# EAGLE design thermometer (EAGLE 7.2.0)
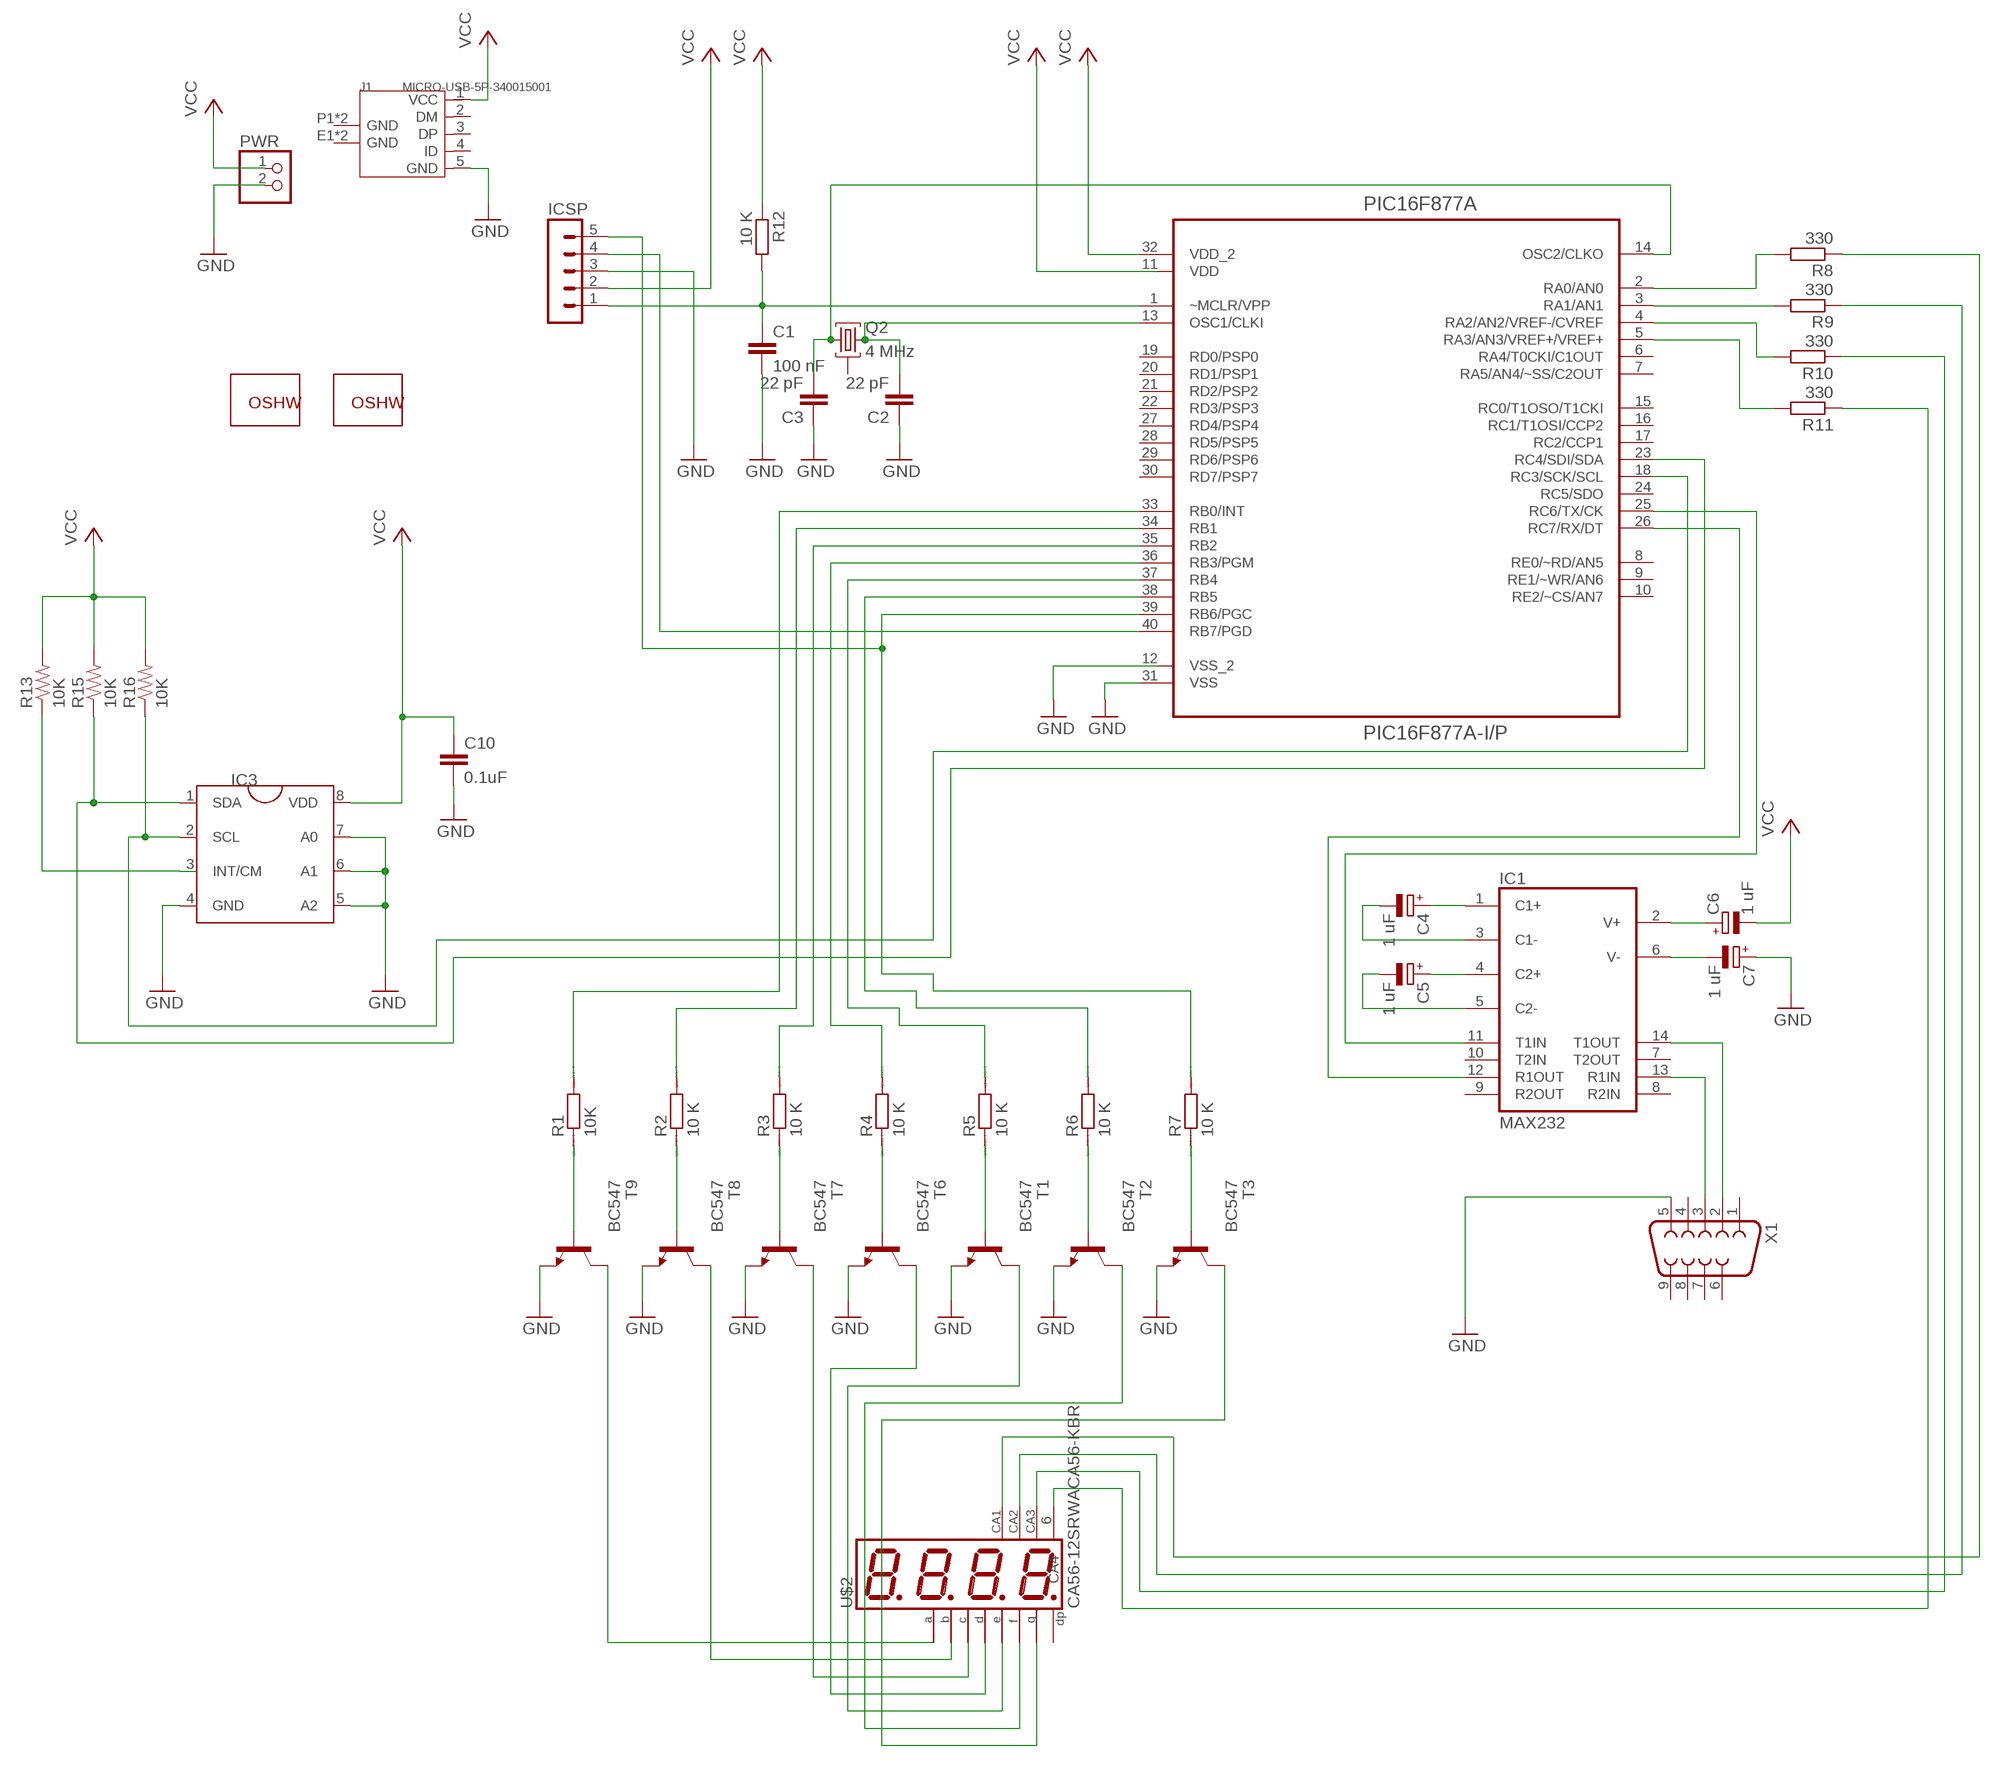
[diagram p0: schematic, sheet 1]

## Parts
C1  100 nF  C-EU050-025X075  [C050-025X075]
C2  22 pF  C-EU050-025X075  [C050-025X075]
C3  22 pF  C-EU050-025X075  [C050-025X075]
C4  1 uF  CPOL-EUE1.8-4  [E1,8-4]
C5  1 uF  CPOL-EUE1.8-4  [E1,8-4]
C6  1 uF  CPOL-EUE1.8-4  [E1,8-4]
C7  1 uF  CPOL-EUE1.8-4  [E1,8-4]
C10  0.1uF  0.1UF-25V-5%(0603)  [0603-CAP]
GOLD_ORB_SM1  OSHWLOGO_GOLD_ORB_LG  [OSHW0]
GOLD_ORB_SM2  OSHWLOGO_GOLD_ORB_SM  [OSHW2]
IC1  MAX232  [DIL16]
IC3  TCN75TCN75MUA  [MSOP8]
ICSP  MA05-1  [MA05-1]
J1  MICRO-USB-5P-340015001  [B-SMD-5P]
PIC16F877A  PIC16F877A-I/P  [DIP254P1524X483-40]
PWR  PINHD-1X2  [1X02]
Q2  4 MHz  54M10AUM1  [UM1]
R1  10K  R0207/10  [0207/10]
R2  10 K  R0207/10  [0207/10]
R3  10 K  R0207/10  [0207/10]
R4  10 K  R0207/10  [0207/10]
R5  10 K  R0207/10  [0207/10]
R6  10 K  R0207/10  [0207/10]
R7  10 K  R0207/10  [0207/10]
R8  330  R-EU_0204/7  [0204/7]
R9  330  R-EU_0204/7  [0204/7]
R10  330  R-EU_0204/7  [0204/7]
R11  330  R-EU_0204/7  [0204/7]
R12  10 K  R-EU_0204/7  [0204/7]
R13  10K  10KOHM-1/10W-1%(0603)0603  [0603-RES]
R15  10K  10KOHM-1/10W-1%(0603)0603  [0603-RES]
R16  10K  10KOHM-1/10W-1%(0603)0603  [0603-RES]
T1  BC547  [TO92]
T2  BC547  [TO92]
T3  BC547  [TO92]
T6  BC547  [TO92]
T7  BC547  [TO92]
T8  BC547  [TO92]
T9  BC547  [TO92]
U$2  CA56-12SRWACA56-KBR  [CA56]
X1  F09HP  [F09HP]

## Nets
GND: C1.2 C2.1 C3.1 C7.+ C10.2 IC3.4(GND) IC3.5(A2) IC3.6(A1) IC3.7(A0) ICSP.3 J1.5(GND) PIC16F877A.31(VSS) PWR.2 T1.1(E) T2.1(E) T3.1(E) T6.1(E) T7.1(E) T8.1(E) T9.1(E) X1.5
N$1: R1.1 T9.2(B)
N$2: R2.1 T8.2(B)
N$3: R3.1 T7.2(B)
N$4: R4.1 T6.2(B)
N$5: R5.1 T1.2(B)
N$6: R6.1 T2.2(B)
N$7: R7.1 T3.2(B)
N$8: PIC16F877A.33(RB0/INT) R1.2
N$9: PIC16F877A.34(RB1) R2.2
N$10: PIC16F877A.35(RB2) R3.2
N$11: PIC16F877A.36(RB3/PGM) R4.2
N$12: PIC16F877A.37(RB4) R5.2
N$13: PIC16F877A.38(RB5) R6.2
N$14: ICSP.5 PIC16F877A.39(RB6/PGC) R7.2
N$15: PIC16F877A.2(RA0/AN0) R8.2
N$16: PIC16F877A.3(RA1/AN1) R9.2
N$17: PIC16F877A.4(RA2/AN2/VREF-/CVREF) R10.2
N$18: PIC16F877A.5(RA3/AN3/VREF+/VREF+) R11.2
N$19: R8.1 U$2.12(CA)
N$20: C1.1 ICSP.1 PIC16F877A.1(~MCLR/VPP) R12.2
N$21: R9.1 U$2.9(CA)
N$22: R10.1 U$2.8(CA)
N$23: T9.3(C) U$2.11(A)
N$24: C2.2 PIC16F877A.13(OSC1/CLKI) Q2.3
N$25: T7.3(C) U$2.4(C)
N$26: T6.3(C) U$2.2(D)
N$27: T1.3(C) U$2.1(E)
N$28: T2.3(C) U$2.10(F)
N$29: T3.3(C) U$2.5(G)
N$30: ICSP.4 PIC16F877A.40(RB7/PGD)
N$31: R11.1 U$2.6(CA4)
N$32: IC3.2(SCL) PIC16F877A.18(RC3/SCK/SCL) R16.1
N$33: IC3.1(SDA) PIC16F877A.23(RC4/SDI/SDA) R15.1
N$35: C7.- IC1.6(V-)
N$36: C3.2 PIC16F877A.14(OSC2/CLKO) Q2.1
N$37: C6.+ IC1.2(V+)
N$38: C4.+ IC1.1(C1+)
N$39: C4.- IC1.3(C1-)
N$40: C5.+ IC1.4(C2+)
N$41: C5.- IC1.5(C2-)
N$42: IC1.11(T1IN) PIC16F877A.25(RC6/TX/CK)
N$43: IC1.14(T1OUT) X1.2
N$44: IC1.13(R1IN) X1.3
N$45: IC1.12(R1OUT) PIC16F877A.26(RC7/RX/DT)
N$47: T8.3(C) U$2.7(B)
N$49: IC3.3(INT/CM) R13.1
VCC: C6.- C10.1 IC3.8(VDD) ICSP.2 J1.1(VCC) PIC16F877A.32(VDD_2) PWR.1 R12.1 R13.2 R15.2 R16.2
Unconnected: IC1.7(T2OUT) IC1.8(R2IN) IC1.9(R2OUT) IC1.10(T2IN) J1.2(DM) J1.3(DP) J1.4(ID) J1.E1(GND) J1.E2(GND) J1.P1(GND) J1.P2(GND) PIC16F877A.6(RA4/T0CKI/C1OUT) PIC16F877A.7(RA5/AN4/~SS/C2OUT) PIC16F877A.8(RE0/~RD/AN5) PIC16F877A.9(RE1/~WR/AN6) PIC16F877A.10(RE2/~CS/AN7) PIC16F877A.15(RC0/T1OSO/T1CKI) PIC16F877A.16(RC1/T1OSI/CCP2) PIC16F877A.17(RC2/CCP1) PIC16F877A.19(RD0/PSP0) PIC16F877A.20(RD1/PSP1) PIC16F877A.21(RD2/PSP2) PIC16F877A.22(RD3/PSP3) PIC16F877A.24(RC5/SDO) PIC16F877A.27(RD4/PSP4) PIC16F877A.28(RD5/PSP5) PIC16F877A.29(RD6/PSP6) PIC16F877A.30(RD7/PSP7) Q2.2 U$2.3(DP) X1.1 X1.4 X1.6 X1.7 X1.8 X1.9

## Power pins joined to a net without a drawn wire
GND: IC1.15(GND)
VCC: IC1.16(VCC)
VDD: PIC16F877A.11(VDD)
VSS_2: PIC16F877A.12(VSS_2)

## Library data of the parts
C1-C3 = rcl:C-EU: CAPACITOR, European symbol
C4-C7 = rcl:CPOL-EU: POLARIZED CAPACITOR, European symbol
C10 = SparkFun-Capacitors:0.1UF-25V-5%(0603): CAP-08604; PROD_ID: CAP-08604
GOLD_ORB_SM1 GOLD_ORB_SM2 = NBitWonder:OSHWLOGO: These are Open-Source Hardware logos.
IC1 = maxim:MAX232: RS232 TRANSCEIVER; MF: MAXIM; MPN: MAX232ACPE+; OC_FARNELL: 9723773; OC_NEWARK: 68K4544
IC3 = instruction_set:TCN75: The TCN75 is a serially programmable temperature sensor that notifies the host controller when ambient temperature exceeds a user-programmed setpoint. Hysteresis is also programmable. The INT/CMPTR output is programmable as either a simple comparator for thermostat operation or as a temperature event interrupt. Communication with the TCN75 is accomplished via a two-wire bus that is compatible with industry standard protocols. This permits reading the current temperature, programming the setpoint and hysteresis, and configuring the device.
ICSP = con-lstb:MA05-1: PIN HEADER; OC_FARNELL: unknown; OC_NEWARK: unknown
J1 = Connector:MICRO-USB-5P: When you use the footprint ,place notice 46 (layer)milling ,there is some important information.
PIC16F877A = Microchip_By_element14_Batch_1:PIC16F877A-I/P: 8-Bit CMOS FLASH Microcontrollers; MPN: PIC16F877A-I/P; OC_FARNELL: 9761446; OC_NEWARK: 69K7640; PACKAGE: DIP-40; SUPPLIER: Microchip
PWR = pinhead:PINHD-1X2: PIN HEADER
Q2 = crystal:54M10AUM1: Monolithic Crystal Filters Source: www.vanlong.com; OC_FARNELL: unknown; OC_NEWARK: unknown
R1-R7 = eagle-ltspice:R: RESISTOR, European symbol; SPICEMODEL: NONE; SPICEPREFIX: R
R8-R11 = resistor:R-EU_: RESISTOR, European symbol
R12 = rcl:R-EU_: RESISTOR, European symbol
R13 R15 R16 = SparkFun-Resistors:10KOHM-1/10W-1%(0603): RES-00824; PROD_ID: RES-00824
T1-T3 T6-T9 = transistor:BC547: NPN TRANSISTOR
U$2 = display-kingbright:CA56-12SRWA: 14.22mm (0.56INCH) FOUR DIGIT NUMERIC DISPLAY Description The Super Bright Red source color devices are made with Gallium Aluminum Arsenide Red Light Emitting Diode. https://www.kingbrightusa.com/images/catalog/spec/CA56-12SRWA.pdf
X1 = con-subd:F09: SUB-D; OC_FARNELL: unknown; OC_NEWARK: unknown

## Net classes
0 default: width 0.254 mm, drill 0.508 mm, clearance 0.254 mm

## Board
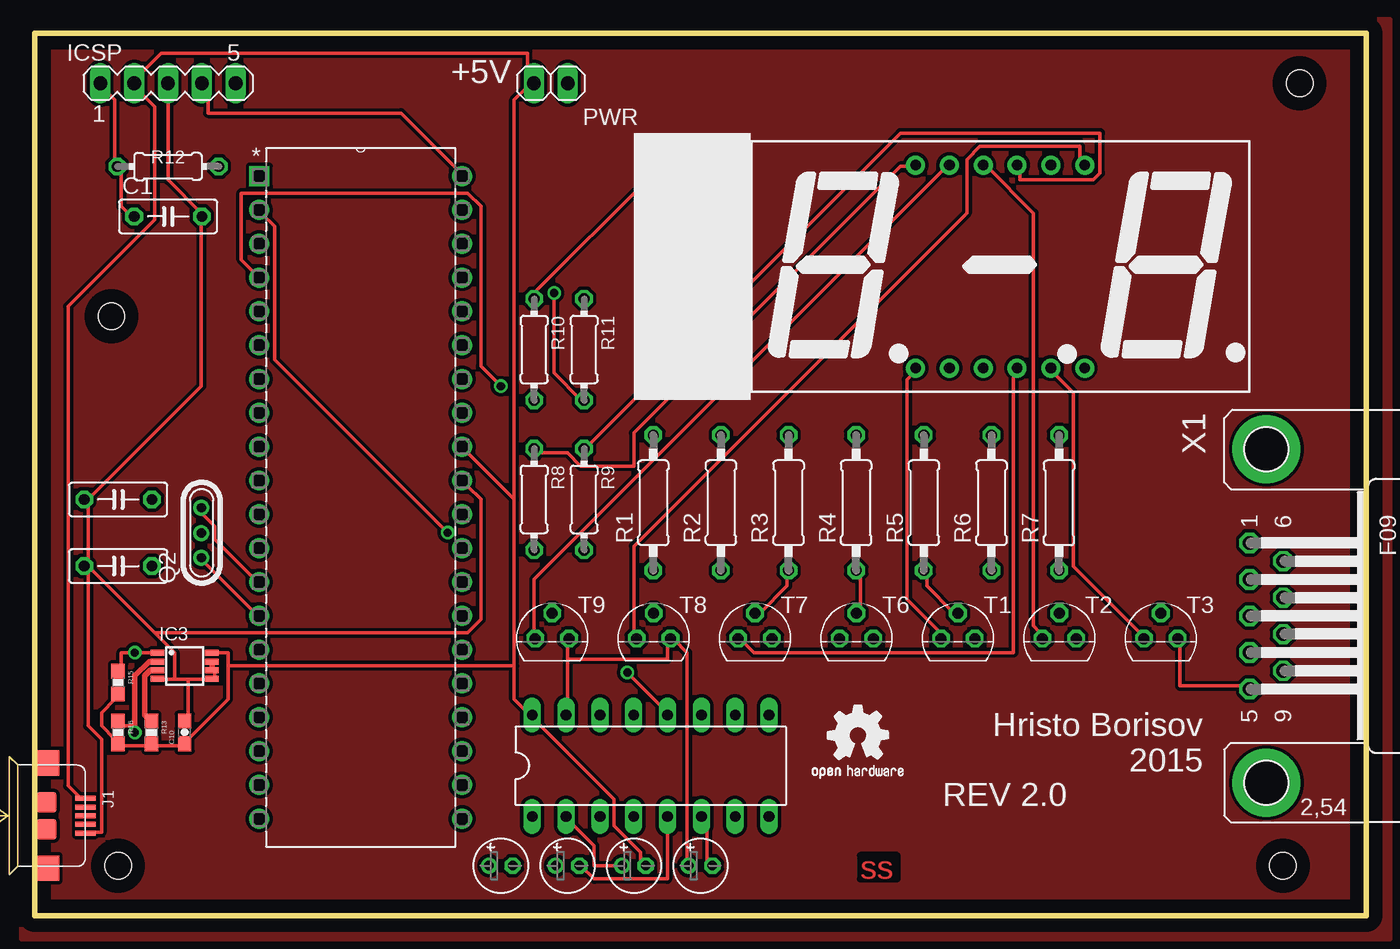
[diagram p1: board, top side]
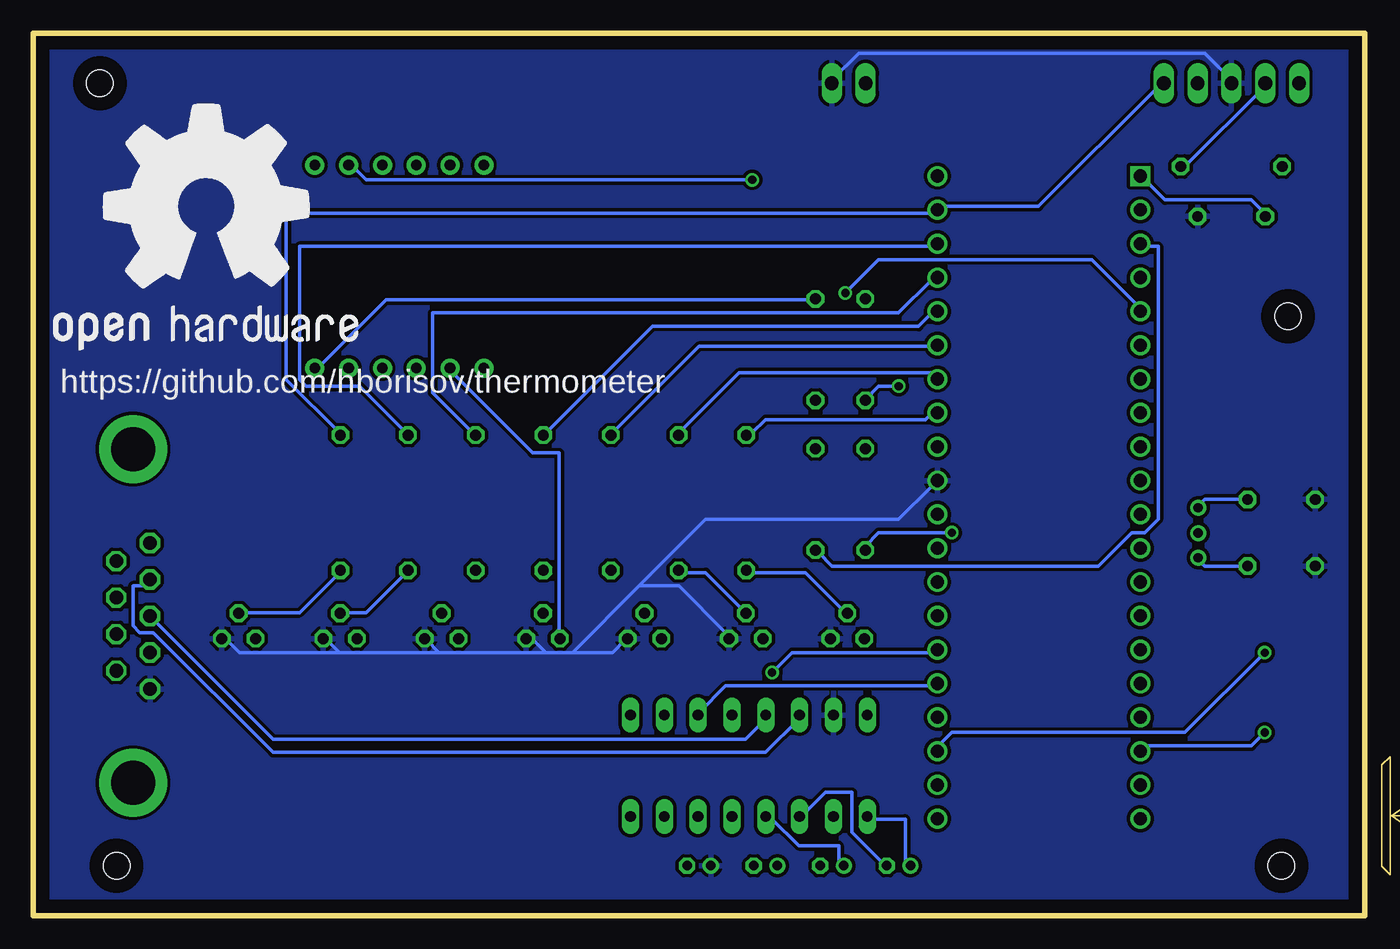
[diagram p2: board, bottom side, seen from below]

Size 100 x 66.25 mm. Coordinates in mm from the lower left corner, seen from the top.
Outline: 0,0 100,0 100,66.25 0,66.25 0,0
Copper layers (1*16): Top 0.035mm / dielectric 1.5mm / Bottom 0.035mm
Design rules "default": minimum track width 10mil, minimum drill 24mil, track to track 8mil, track to pad 8mil, pad to pad 8mil, via to via 8mil, smd to smd 8mil, copper to edge 40mil, drill to drill 8mil, minimum pad ring 10mil, minimum via ring 8mil, stop-mask expansion 4mil, vias tented up to drill 0mil, thermal gap 10mil
Holes 2 mm at 6.25,3.75 5.75,45 95,62.5 93.75,3.75

### Footprints (pad centres in the part's own frame; a part is rotated, then mirrored left to right if it is on the bottom)
C050-025X075 = drill 0.813 octagon: 1 -2.54,0; 2 2.54,0
E1,8-4 = drill 0.711 pad 1.168: + -0.889,0 | drill 0.711 pad 1.168 octagon: - 0.889,0
0603-CAP = smd 1.1 x 1: 1 -0.85,0; 2 0.85,0
DIL16 = drill 0.813 long: 1 -8.89,-3.81; 2 -6.35,-3.81; 3 -3.81,-3.81; 4 -1.27,-3.81; 5 1.27,-3.81; 6 3.81,-3.81; 7 6.35,-3.81; 8 8.89,-3.81; 9 8.89,3.81; 10 6.35,3.81; 11 3.81,3.81; 12 1.27,3.81; 13 -1.27,3.81; 14 -3.81,3.81; 15 -6.35,3.81; 16 -8.89,3.81
MSOP8 = smd 0.45 x 1: 1 -0.975,-2.05; 2 -0.325,-2.05; 3 0.325,-2.05; 4 0.975,-2.05; 5 0.975,2.05; 6 0.325,2.05; 7 -0.325,2.05; 8 -0.975,2.05
MA05-1 = drill 1.016 long: 1 -5.08,0; 2 -2.54,0; 3 0,0; 4 2.54,0; 5 5.08,0
B-SMD-5P = smd 0.38 x 1.52: 1 -1.3,2.54; 2 -0.65,2.54; 3 0,2.54; 4 0.65,2.54; 5 1.3,2.54 | smd 1.524 x 1.524: E1 -1.016,-0.381; E2 1.016,-0.381 | smd 1.9 x 1.9: P1 -3.95,-0.381; P2 3.95,-0.381
DIP254P1524X483-40 = drill 0.991 square: 1 -15.24,48.26 | drill 0.991: 2 -15.24,45.72; 3 -15.24,43.18; 4 -15.24,40.64; 5 -15.24,38.1; 6 -15.24,35.56; 7 -15.24,33.02; 8 -15.24,30.48; 9 -15.24,27.94; 10 -15.24,25.4; 11 -15.24,22.86; 12 -15.24,20.32; 13 -15.24,17.78; 14 -15.24,15.24; 15 -15.24,12.7; 16 -15.24,10.16; 17 -15.24,7.62; 18 -15.24,5.08; 19 -15.24,2.54; 20 -15.24,0; 21 0,0; 22 0,2.54; 23 0,5.08; 24 0,7.62; 25 0,10.16; 26 0,12.7; 27 0,15.24; 28 0,17.78; 29 0,20.32; 30 0,22.86; 31 0,25.4; 32 0,27.94; 33 0,30.48; 34 0,33.02; 35 0,35.56; 36 0,38.1; 37 0,40.64; 38 0,43.18; 39 0,45.72; 40 0,48.26
1X02 = drill 1.016 long: 1 -1.27,0; 2 1.27,0
UM1 = drill 0.7 pad 1.2: 1 -1.875,0; 2 -0.027,0; 3 1.875,0
0207/10 = drill 0.813 octagon: 1 -5.08,0; 2 5.08,0
0204/7 = drill 0.813 octagon: 1 -3.81,0; 2 3.81,0
0603-RES = smd 1.1 x 1: 1 -0.85,0; 2 0.85,0
TO92 = drill 0.813 octagon: 1 1.27,0; 2 0,1.905; 3 -1.27,0
CA56 = drill 0.8 pad 1.422: 1 -6.35,-8.89; 2 -3.81,-8.89; 3 -1.27,-8.89; 4 1.27,-8.89; 5 3.81,-8.89; 6 6.35,-8.89; 7 6.35,6.35; 8 3.81,6.35; 9 1.27,6.35; 10 -1.27,6.35; 11 -3.81,6.35; 12 -6.35,6.35
F09HP = drill 1.016 octagon: 1 -5.486,-1.27; 2 -2.743,-1.27; 3 0,-1.27; 4 2.743,-1.27; 5 5.486,-1.27; 6 -4.115,1.27; 7 -1.372,1.27; 8 1.372,1.27; 9 4.115,1.27 | drill 3.302 pad 5.08: G1 -12.522,0; G2 12.522,0

### Placement (x,y rotation side)
C1  10,52.5 0 top
C2  6.25,31.25 0 top
C3  6.25,26.25 0 top
C4  35,3.75 0 top
C5  40,3.75 0 top
C6  45,3.75 0 top
C7  50,3.75 0 top
C10  11.25,13.75 90 top
GOLD_ORB_SM1  99.75,39 0 bottom
GOLD_ORB_SM2  58,9.25 0 top
IC1  46.25,11.25 0 top
IC3  11.25,18.75 270 top
ICSP  10,62.5 0 top
J1  1.25,7.5 270 top
PIC16F877A  32.09,7.27 0 top
PWR  38.75,62.5 0 top
Q2  12.5,28.75 90 top
R1  46.45,31 90 top
R2  51.53,31 90 top
R3  56.61,31 90 top
R4  61.69,31 90 top
R5  66.77,31 90 top
R6  71.85,31 90 top
R7  76.93,31 90 top
R8  37.5,31.25 270 top
R9  41.25,31.25 270 top
R10  37.5,42.5 270 top
R11  41.25,42.5 270 top
R12  10,56.25 180 top
R13  8.75,13.75 270 top
R15  6.25,17.5 270 top
R16  6.25,13.75 270 top
T1  69.33,20.8 0 top
T2  76.95,20.8 0 top
T3  84.57,20.8 0 top
T6  61.71,20.8 0 top
T7  54.09,20.8 0 top
T8  46.47,20.8 0 top
T9  38.85,20.8 0 top
U$2  72.5,50 0 top
X1  92.5,22.5 270 top

### Tracks (layer width: path | path; a pad name or v marks a point on that pad's centre or on a via)
GND
  Top 0.254: 40,19.25 40,20.75 T9.1 | 40,19.25 40,15.25 IC1.15 | C7.+ 49,3.75 49,19.75 48,20.75 T8.1 47.5,20.75 47.5,19.25 40,19.25 | X1.5 91,17.25 86,17.25 86,20.75 T3.1 | 11.5,17.75 13,17.75 IC3.5 13.5,17.75 13.5,18.25 IC3.6 | 11.5,17.75 10.5,17.75 | 10.5,17.75 9.5,17.75 IC3.4 | 11.5,17.75 11.5,14.75 C10.2 | 4,26.25 4,14.25 5,13.25 5,6.25 4,6.25 J1.5 | 4,26.25 4,31.25 | 10.5,17.75 10.5,19.75 9,21.25 | 4,26.25 9,21.25 | 4,26.25 C3.1 | ICSP.3 10,55.25 12.5,52.75 C1.2 12.5,52.25 12.5,39.75 4,31.25 | 4,31.25 C2.1 | 9,21.25 32.5,21.25 33.5,22.25 33.5,31.25 32.5,32.25 PIC16F877A.31
  Top 0.406: IC3.7 IC3.6
  Bottom 0.254: 61.5,19.75 59.5,19.75 | 59.5,19.75 56.5,19.75 55.5,20.75 T7.1 | 61.5,19.75 62.5,20.75 T6.1 | 69.5,19.75 70.5,20.75 T1.1 | 61.5,19.75 69.5,19.75 | 77,19.75 78,20.75 T2.1 | 69.5,19.75 77,19.75 | 77,19.75 84.5,19.75 85.5,20.75 T3.1 | 59.5,19.75 54.5,24.75 | 54.5,24.75 49.5,29.75 35,29.75 32.5,32.25 PIC16F877A.31 | 54.5,24.75 51.5,24.75 48,21.25 T8.1 | PWR.2 40,62.75 38,64.75 12,64.75 10,62.75 ICSP.3
  pour Bottom: -4.75,70 104.5,70 104.5,-6.25 -4.75,-6.25
N$1
  Bottom 0.254: T9.2 39,22.75 42,25.75 46,25.75 R1.1
N$2
  Bottom 0.254: T8.2 46.5,22.75 49.5,25.75 51.5,25.75 R2.1
N$3
  Top 0.254: T7.2 54.5,22.75 56.5,24.75 56.5,25.75 R3.1
N$4
  Top 0.254: R4.1 62,25.75 62,22.75 T6.2
N$5
  Top 0.254: T1.2 69,22.75 67,24.75 67,25.75 R5.1
N$6
  Bottom 0.254: R6.1 72,25.75 75,22.75 76.5,22.75 T2.2
N$7
  Bottom 0.254: R7.1 77,25.75 80,22.75 84.5,22.75 T3.2
N$8
  Bottom 0.254: R1.2 46,36.25 45,37.25 33,37.25 32.5,37.75 PIC16F877A.33
N$9
  Bottom 0.254: R2.2 51.5,36.25 47,40.75 32.5,40.75 PIC16F877A.34
N$10
  Bottom 0.254: R3.2 56.5,36.25 50,42.75 32.5,42.75 PIC16F877A.35
N$11
  Bottom 0.254: R4.2 61.5,36.25 53.5,44.25 33.5,44.25 32.5,45.25 PIC16F877A.36
N$12
  Bottom 0.254: R5.2 67,36.25 70,39.25 70,45.25 35,45.25 32.5,47.75 PIC16F877A.37
N$13
  Bottom 0.254: R6.2 72,36.25 75.5,39.75 79.5,39.75 80,40.25 80,50.25 32.5,50.25 PIC16F877A.38
N$14
  Bottom 0.254: R7.2 77,36.25 81,40.25 81,52.75 32.5,52.75 PIC16F877A.39 32,53.25 24.5,53.25 15.5,62.25 ICSP.5
N$15  (via drill 0.61)
  Top 0.254: v31,28.75 18,41.75 18,51.75 17,52.75 PIC16F877A.2
  Bottom 0.254: v31,28.75 36.5,28.75 37.5,27.75 R8.2
N$16
  Bottom 0.254: R9.2 41,27.25 40,26.25 20,26.25 17.5,28.75 16.5,28.75 15.5,29.75 15.5,50.25 16.5,50.25 PIC16F877A.3
N$17  (via drill 0.61)
  Top 0.254: v35,39.75 33.5,41.25 33.5,53.25 32.5,54.25 15.5,54.25 15.5,49.25 16.5,48.25 PIC16F877A.4
  Bottom 0.254: v35,39.75 36.5,39.75 37.5,38.75 R10.2
N$18  (via drill 0.61)
  Top 0.254: v39,46.75 39,40.75 41,38.75 R11.2
  Bottom 0.254: v39,46.75 36.5,49.25 20.5,49.25 17,45.75 PIC16F877A.5
N$19
  Top 0.254: R8.1 37.5,34.75 40,34.75 41,33.75 45,33.75 45,36.25 65,56.25 66,56.25 U$2.12
N$20
  Top 0.254: C1.1 7,52.75 6.5,53.25 6.5,56.25 R12.2 6,56.25 6,61.25 5,62.25 ICSP.1
  Bottom 0.254: PIC16F877A.1 16.5,55.25 15,53.75 8.5,53.75 7.5,52.75 C1.1
N$21
  Top 0.254: R9.1 41.5,35.25 65,58.75 80,58.75 80,55.75 79.5,55.25 74,55.25 74,56.25 U$2.9
N$22  (via drill 0.61)
  Top 0.254: v46,55.25 37.5,46.75 R10.1
  Bottom 0.254: v46,55.25 75,55.25 76,56.25 U$2.8
N$23
  Top 0.254: T9.3 37.5,21.25 37.5,25.25 68.5,56.25 U$2.11
N$24
  Top 0.254: PIC16F877A.13 16.5,25.25 13.5,28.25 13.5,29.25 12.5,30.25 Q2.3
  Bottom 0.254: C2.2 12,31.25 12.5,30.75 Q2.3
N$25
  Top 0.254: T7.3 53,20.75 54,19.75 73.5,19.75 73.5,40.75 U$2.4
N$26
  Bottom 0.254: T6.3 60.5,21.25 60.5,34.75 62.5,34.75 68.5,40.75 U$2.2
N$27
  Top 0.254: T1.3 68,21.25 65.5,23.75 65.5,40.25 66,40.75 U$2.1
N$28
  Top 0.254: T2.3 75.5,21.25 75,21.75 75,52.75 71.5,56.25 U$2.10
N$29
  Top 0.254: T3.3 83,21.25 78,26.25 78,39.25 76.5,40.75 U$2.5
N$30
  Top 0.254: PIC16F877A.40 32,55.75 27.5,60.25 13,60.25 13,62.25 ICSP.4
N$31
  Bottom 0.254: R11.1 41.5,46.25 73.5,46.25 78.5,41.25 U$2.6
N$32  (via drill 0.61)
  Top 0.254: v7.5,13.75 7.5,14.25 6.5,14.25 R16.1
  Top 0.406: IC3.2 8.57,19.08 7.5,18 7.5,14.25
  Bottom 0.254: v7.5,13.75 8.5,12.75 16.5,12.75 PIC16F877A.18
N$33  (via drill 0.61)
  Top 0.254: IC3.1 9,19.75 v7.5,19.75 6.5,19.75 6.5,18.75 R15.1
  Bottom 0.254: v7.5,19.75 13.5,13.75 31,13.75 32,12.75 PIC16F877A.23
N$34
  pour Top: -1,67.25 101.75,67.25 101.75,-1.75 -1,-1.75
N$35
  Top 0.254: C7.- 50.5,3.75 50.5,7.25 IC1.6
N$36
  Top 0.254: PIC16F877A.14 16.5,22.75 12.5,26.75 Q2.1
  Bottom 0.254: C3.2 12,26.25 12.5,26.75 Q2.1
N$37
  Top 0.254: C6.+ 42,3.75 42,5.25 40,7.25 IC1.2
N$38
  Bottom 0.254: C4.+ 34.5,3.75 34.5,7.25 37,7.25 IC1.1
N$39
  Bottom 0.254: C4.- 36,3.75 38.5,6.25 38.5,9.25 40.5,9.25 42,7.75 IC1.3
N$40
  Bottom 0.254: C5.+ 39.5,3.75 39.5,5.25 42.5,5.25 44.5,7.25 IC1.4
N$41
  Top 0.254: C5.- 41,3.75 42,2.75 47.5,2.75 47.5,7.25 IC1.5
N$42
  Bottom 0.254: IC1.11 50,15.25 48,17.25 32.5,17.25 PIC16F877A.25
N$43
  Bottom 0.254: IC1.14 42.5,14.75 45,12.25 82,12.25 91,21.25 92,21.25 92.5,21.75 92.5,24.75 91.5,24.75 X1.2
N$44
  Bottom 0.254: IC1.13 45,14.75 46.5,13.25 82,13.25 91,22.25 X1.3
N$45  (via drill 0.61)
  Top 0.254: v44.5,18.25 47.5,15.25 IC1.12
  Bottom 0.254: v44.5,18.25 43,19.75 32.5,19.75 PIC16F877A.26
N$47
  Top 0.254: T8.3 45,21.25 45,27.75 70,52.75 70,56.75 71,57.75 78.5,57.75 78.5,56.75 U$2.7
N$49
  Top 0.406: IC3.3 8.68,18.42 8.25,18 8.25,15.1 R13.1
VCC
  Top 0.254: J1.1 3.5,8.75 2.5,9.75 2.5,45.75 9,52.25 9,60.75 7.5,62.25 ICSP.2 7.5,62.75 9.5,64.75 37,64.75 37,62.75 PWR.1 37,62.25 36,61.25 36,31.25 | R15.2 6,16.25 5,15.25 5,14.25 6,13.25 R16.2 6.5,12.75 8.5,12.75 R13.2 9,12.75 11,12.75 C10.1 11.5,13.25 14.5,16.25 14.5,18.75 | 14.5,18.75 14.5,19.75 13.5,19.75 IC3.8 | C6.- 45.5,3.75 45.5,4.75 43.5,6.75 43.5,8.75 37.5,14.75 IC1.16 37,15.25 36,16.25 36,18.75 | 36,31.25 32.5,34.75 PIC16F877A.32 | 36,18.75 36,31.25 | 36,18.75 14.5,18.75
  Bottom 0.254: R12.1 13.5,56.25 7.5,62.25 ICSP.2

### Text on the board
Top: ss
tNames: +5V | Hristo Borisov / 2015 | REV 2.0
bNames: https://github.com/hborisov/thermometer